# Altium schematic sheet 16_seg_display.SchDoc
size A4
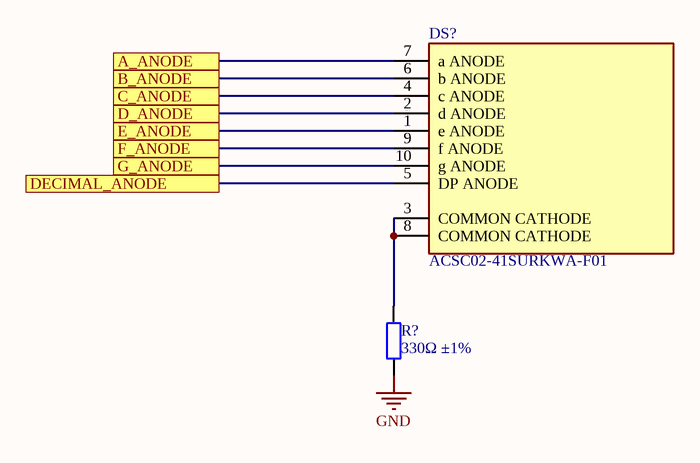
[diagram p0: 16_seg_display.SchDoc]

## Parts
DS?  ACSC02-41SURKWA-F01  [FP-ACSC02-41SURKWA-F01-MFG]
R?  330Ω ±1%  [0603_R]

## Ports
A_ANODE, B_ANODE, C_ANODE, D_ANODE, DECIMAL_ANODE, E_ANODE, F_ANODE, G_ANODE

## Nets
GND: R?.1
A_ANODE: DS?.7(a_ANODE) ; port A_ANODE
B_ANODE: DS?.6(b_ANODE) ; port B_ANODE
C_ANODE: DS?.4(c_ANODE) ; port C_ANODE
D_ANODE: DS?.2(d_ANODE) ; port D_ANODE
DECIMAL_ANODE: DS?.5(DP_ANODE) ; port DECIMAL_ANODE
E_ANODE: DS?.1(e_ANODE) ; port E_ANODE
F_ANODE: DS?.9(f_ANODE) ; port F_ANODE
G_ANODE: DS?.10(g_ANODE) ; port G_ANODE
NetDS?_3: DS?.3(COMMON_CATHODE) DS?.8(COMMON_CATHODE) R?.2

## Library data of the parts
DS? = CMP-44525-000002-1: DISPLAY 7-SEG 0.2" SGL RED 10SMD; Element Configuration: Common Cathode; Operating Supply Voltage: 1.95V; Wavelength: 630nm; Power Consumption: 75mW; Number of Characters: 1; Forward Current: 30mA; Test Current: 20mA; Luminous Intensity: 30mcd; Min Operating Temperature: -40°C; Package Quantity: 650; Height: 0.315inch; Packaging: Tape and Reel; Width: 0.272inch; Max Power Dissipation: 75mW; Color: Red; Illumination Color: Red; Lead Free: Lead Free; Case/Package: SMD/SMT; Max Operating Temperature: 85°C; Forward Voltage: 1.95V
R? = 0603 330R (3300) 1%: Chip resistor; Manufacturer: Uniroyal Elec; PartNumber: 0603WAF3300T5E; Power: 1/10W; ComponentLink1Description: Supplier link; ComponentLink1URL: http://www.szlcsc.com/product/details_23865.html; Package: 0603; Supplier: LC; SuppliersPartNumber: C23138; Resistance: 330Ω; Tolerance: 1%